# Altium schematic sheet 05_LMS7002M_RF.SchDoc: LMS7002M RF
size A3; Organization: Lime Microsystems; Address1: Surrey Tech Centre; Address2: Guildford GU2 7YG; Address3: Surrey; Address4: United Kingdom; Revision: v1.2; SheetNumber: 5; SheetTotal: 14
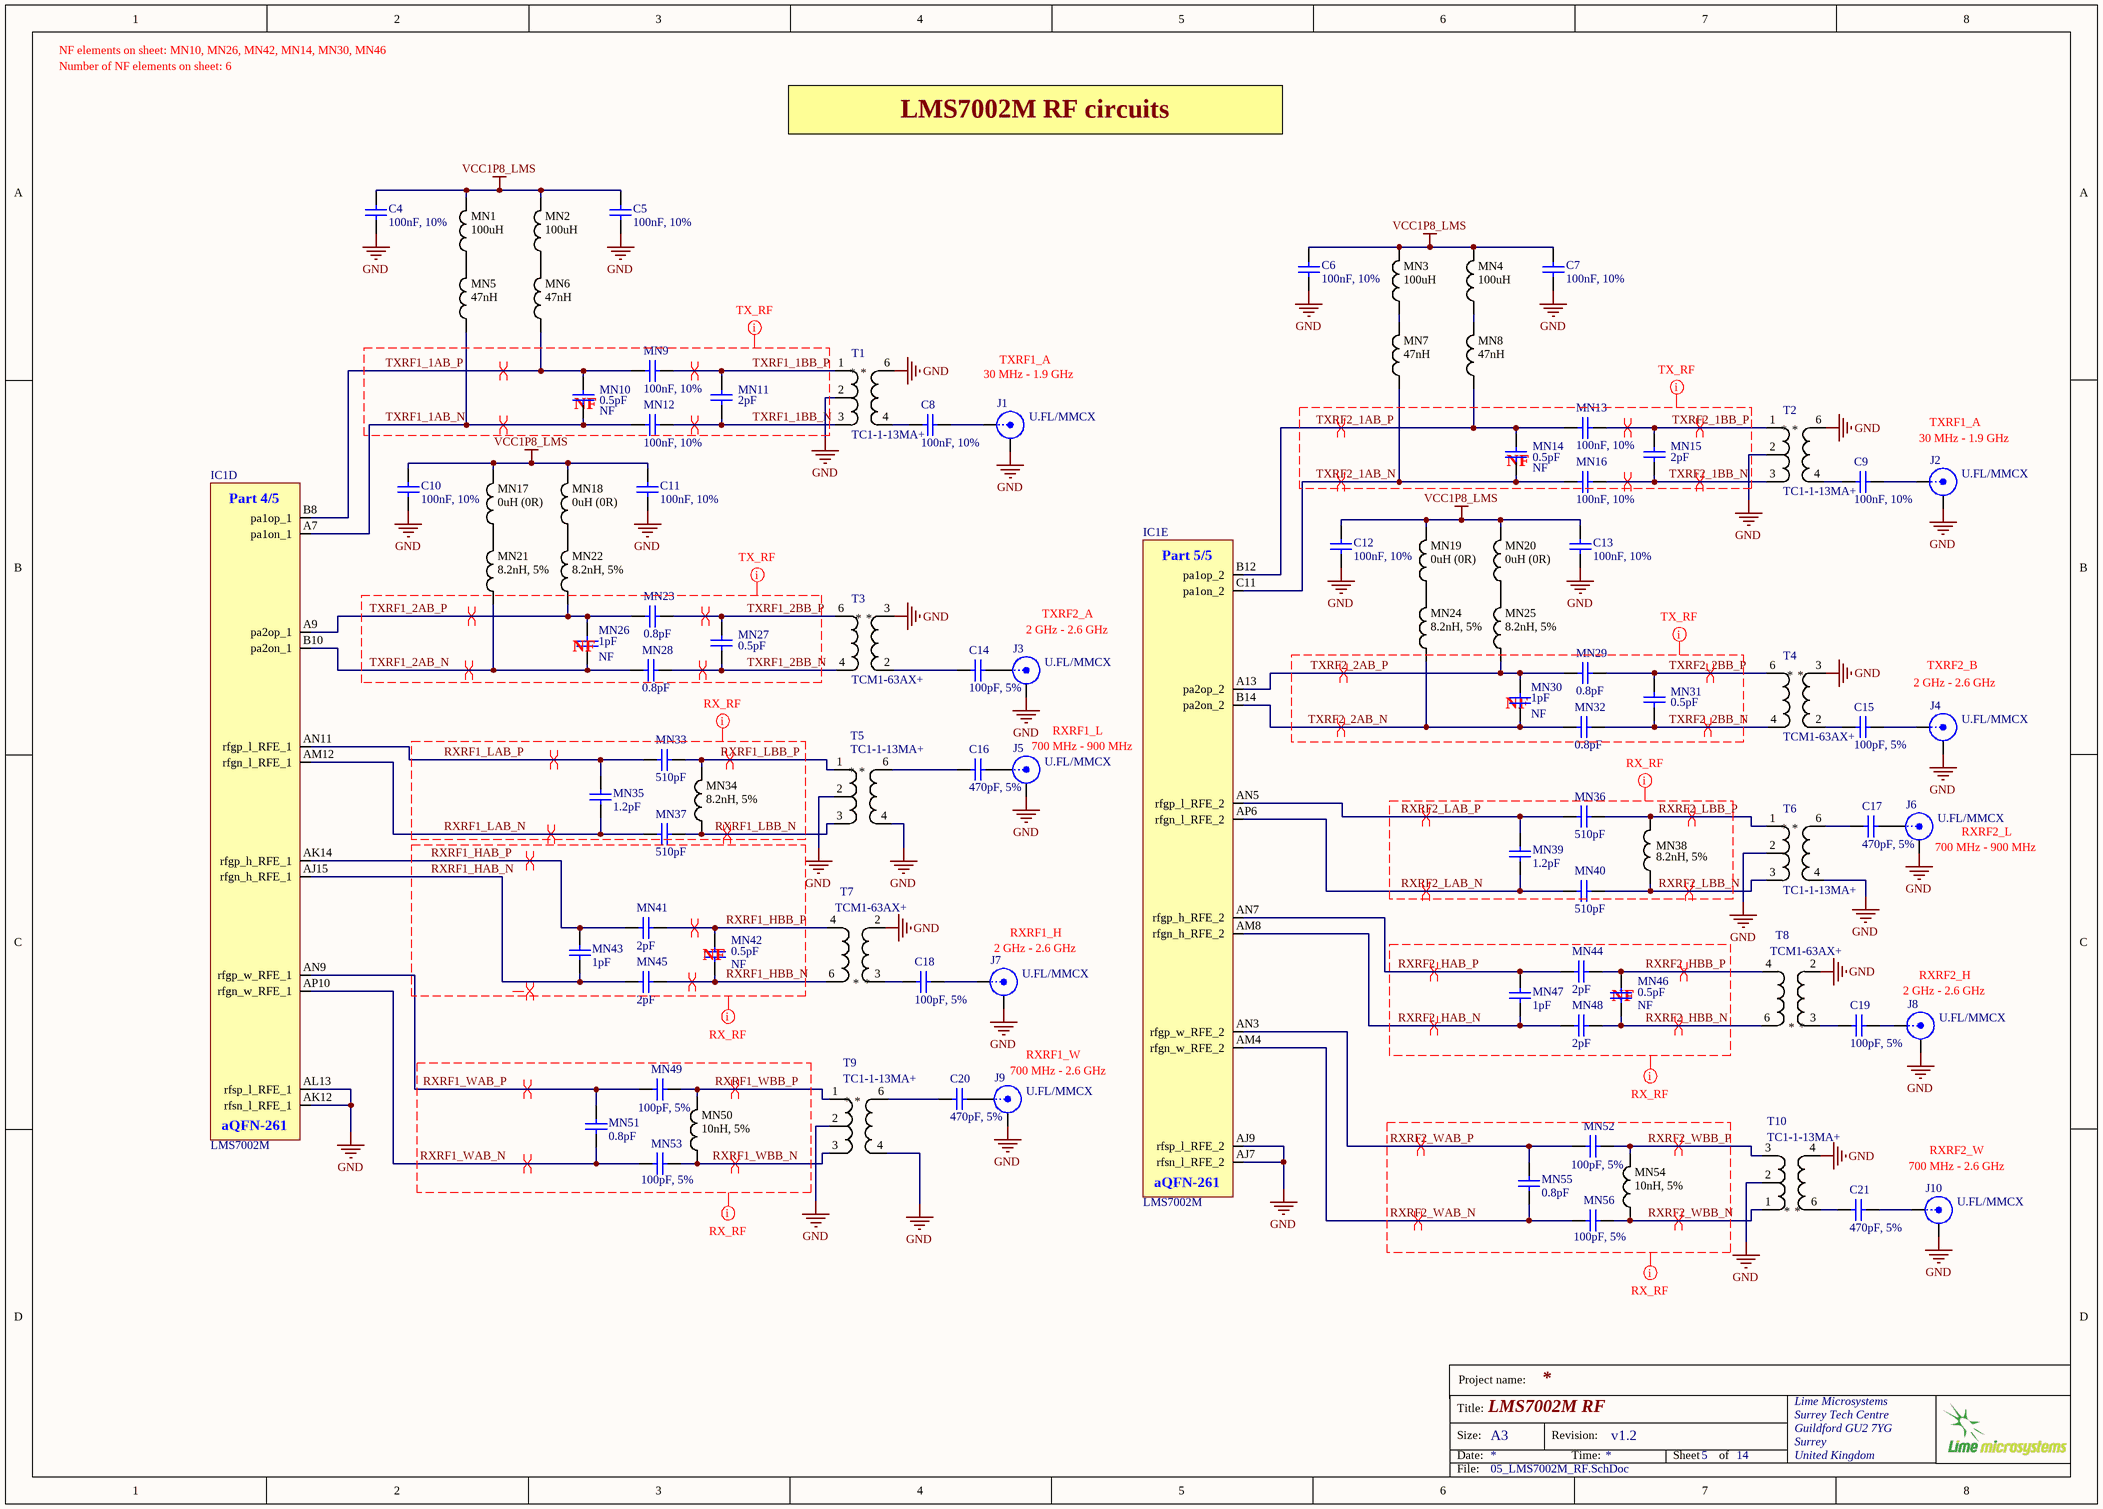
[diagram p0: 05_LMS7002M_RF.SchDoc]

## Parts
C4  100nF, 10%  [CAP0402]
C5  100nF, 10%  [CAP0402]
C6  100nF, 10%  [CAP0402]
C7  100nF, 10%  [CAP0402]
C8  100nF, 10%  [CAP0402]
C9  100nF, 10%  [CAP0402]
C10  100nF, 10%  [CAP0402]
C11  100nF, 10%  [CAP0402]
C12  100nF, 10%  [CAP0402]
C13  100nF, 10%  [CAP0402]
C14  100pF, 5%  [CAP0402]
C15  100pF, 5%  [CAP0402]
C16  470pF, 5%  [CAP0402]
C17  470pF, 5%  [CAP0402]
C18  100pF, 5%  [CAP0402]
C19  100pF, 5%  [CAP0402]
C20  470pF, 5%  [CAP0402]
C21  470pF, 5%  [CAP0402]
IC1  LMS7002M  [LMS7002M]  (parts D,E of 5)
J1  U.FL/MMCX  [MMCX_UFL_conn_u]
J2  U.FL/MMCX  [MMCX_UFL_conn_u]
J3  U.FL/MMCX  [MMCX_UFL_conn_u]
J4  U.FL/MMCX  [MMCX_UFL_conn_u]
J5  U.FL/MMCX  [MMCX_UFL_conn_u]
J6  U.FL/MMCX  [MMCX_UFL_conn_u]
J7  U.FL/MMCX  [MMCX_UFL_conn_u]
J8  U.FL/MMCX  [MMCX_UFL_conn_u]
J9  U.FL/MMCX  [MMCX_UFL_conn_u]
J10  U.FL/MMCX  [MMCX_UFL_conn_u]
MN1  100uH  [RES0805]
MN2  100uH  [RES0805]
MN3  100uH  [RES0805]
MN4  100uH  [RES0805]
MN5  47nH  [RES0402]
MN6  47nH  [RES0402]
MN7  47nH  [RES0402]
MN8  47nH  [RES0402]
MN9  100nF, 10%  [CAP0402]
MN10  0.5pF  Assembly Info: NF  [CAP0402]
MN11  2pF  [CAP0402]
MN12  100nF, 10%  [CAP0402]
MN13  100nF, 10%  [CAP0402]
MN14  0.5pF  Assembly Info: NF  [CAP0402]
MN15  2pF  [CAP0402]
MN16  100nF, 10%  [CAP0402]
MN17  0uH (0R)  [RES0805]
MN18  0uH (0R)  [RES0805]
MN19  0uH (0R)  [RES0805]
MN20  0uH (0R)  [RES0805]
MN21  8.2nH, 5%  [RES0402]
MN22  8.2nH, 5%  [RES0402]
MN23  0.8pF  [CAP0402]
MN24  8.2nH, 5%  [RES0402]
MN25  8.2nH, 5%  [RES0402]
MN26  1pF  Assembly Info: NF  [CAP0402]
MN27  0.5pF  [CAP0402]
MN28  0.8pF  [CAP0402]
MN29  0.8pF  [CAP0402]
MN30  1pF  Assembly Info: NF  [CAP0402]
MN31  0.5pF  [CAP0402]
MN32  0.8pF  [CAP0402]
MN33  510pF  [CAP0402]
MN34  8.2nH, 5%  [RES0402]
MN35  1.2pF  [CAP0402]
MN36  510pF  [CAP0402]
MN37  510pF  [CAP0402]
MN38  8.2nH, 5%  [RES0402]
MN39  1.2pF  [CAP0402]
MN40  510pF  [CAP0402]
MN41  2pF  [CAP0402]
MN42  0.5pF  Assembly Info: NF  [CAP0402]
MN43  1pF  [CAP0402]
MN44  2pF  [CAP0402]
MN45  2pF  [CAP0402]
MN46  0.5pF  Assembly Info: NF  [CAP0402]
MN47  1pF  [CAP0402]
MN48  2pF  [CAP0402]
MN49  100pF, 5%  [CAP0402]
MN50  10nH, 5%  [RES0402]
MN51  0.8pF  [CAP0402]
MN52  100pF, 5%  [CAP0402]
MN53  100pF, 5%  [CAP0402]
MN54  10nH, 5%  [RES0402]
MN55  0.8pF  [CAP0402]
MN56  100pF, 5%  [CAP0402]
T1  TC1-1-13MA+  [TC1-1-13MA+_v2]
T2  TC1-1-13MA+  [TC1-1-13MA+_v2]
T3  TCM1-63AX+  [TCM1-63AX+_v2]
T4  TCM1-63AX+  [TCM1-63AX+_v2]
T5  TC1-1-13MA+  [TC1-1-13MA+_v2]
T6  TC1-1-13MA+  [TC1-1-13MA+_v2]
T7  TCM1-63AX+  [TCM1-63AX+_v2]
T8  TCM1-63AX+  [TCM1-63AX+_v2]
T9  TC1-1-13MA+  [TC1-1-13MA+_v2]
T10  TC1-1-13MA+  [TC1-1-13MA+_v2]

## Nets
GND: C4.1 C5.1 C6.1 C7.1 C10.1 C11.1 C12.1 C13.1 IC1.AJ7(rfsn_l_RFE_2) IC1.AJ9(rfsp_l_RFE_2) IC1.AK12(rfsn_l_RFE_1) IC1.AL13(rfsp_l_RFE_1) J1.2(Y) J2.2(Y) J3.2(Y) J4.2(Y) J5.2(Y) J6.2(Y) J7.2(Y) J8.2(Y) J9.2(Y) J10.2(Y) T1.2 T1.6 T2.2 T2.6 T3.3 T4.3 T5.2 T5.4 T6.2 T6.4 T7.2 T8.2 T9.2 T9.4 T10.2 T10.4
VCC1P8_LMS: C4.2 C5.2 C6.2 C7.2 C10.2 C11.2 C12.2 C13.2 MN1.2 MN2.2 MN3.2 MN4.2 MN17.2 MN18.2 MN19.2 MN20.2
RXRF1_HAB_N: IC1.AJ15(rfgn_h_RFE_1) MN43.1 MN45.2
RXRF1_HAB_P: IC1.AK14(rfgp_h_RFE_1) MN41.2 MN43.2
RXRF1_HBB_N: MN42.1 MN45.1 T7.6
RXRF1_HBB_P: MN41.1 MN42.2 T7.4
RXRF1_LAB_N: IC1.AM12(rfgn_l_RFE_1) MN35.1 MN37.2
RXRF1_LAB_P: IC1.AN11(rfgp_l_RFE_1) MN33.2 MN35.2
RXRF1_LBB_N: MN34.1 MN37.1 T5.3
RXRF1_LBB_P: MN33.1 MN34.2 T5.1
RXRF1_WAB_N: IC1.AP10(rfgn_w_RFE_1) MN51.2 MN53.2
RXRF1_WAB_P: IC1.AN9(rfgp_w_RFE_1) MN49.2 MN51.1
RXRF1_WBB_N: MN50.1 MN53.1 T9.3
RXRF1_WBB_P: MN49.1 MN50.2 T9.1
RXRF2_HAB_N: IC1.AM8(rfgn_h_RFE_2) MN47.1 MN48.2
RXRF2_HAB_P: IC1.AN7(rfgp_h_RFE_2) MN44.2 MN47.2
RXRF2_HBB_N: MN46.1 MN48.1 T8.6
RXRF2_HBB_P: MN44.1 MN46.2 T8.4
RXRF2_LAB_N: IC1.AP6(rfgn_l_RFE_2) MN39.1 MN40.2
RXRF2_LAB_P: IC1.AN5(rfgp_l_RFE_2) MN36.2 MN39.2
RXRF2_LBB_N: MN38.1 MN40.1 T6.3
RXRF2_LBB_P: MN36.1 MN38.2 T6.1
RXRF2_WAB_N: IC1.AM4(rfgn_w_RFE_2) MN55.2 MN56.2
RXRF2_WAB_P: IC1.AN3(rfgp_w_RFE_2) MN52.2 MN55.1
RXRF2_WBB_N: MN54.1 MN56.1 T10.1
RXRF2_WBB_P: MN52.1 MN54.2 T10.3
TXRF1_1AB_N: IC1.A7(pa1on_1) MN5.1 MN10.1 MN12.1
TXRF1_1AB_P: IC1.B8(pa1op_1) MN6.1 MN9.2 MN10.2
TXRF1_1BB_N: MN11.1 MN12.2 T1.3
TXRF1_1BB_P: MN9.1 MN11.2 T1.1
TXRF1_2AB_N: IC1.B10(pa2on_1) MN21.1 MN26.2 MN28.2
TXRF1_2AB_P: IC1.A9(pa2op_1) MN22.1 MN23.2 MN26.1
TXRF1_2BB_N: MN27.1 MN28.1 T3.4
TXRF1_2BB_P: MN23.1 MN27.2 T3.6
TXRF2_1AB_N: IC1.C11(pa1on_2) MN7.1 MN14.1 MN16.1
TXRF2_1AB_P: IC1.B12(pa1op_2) MN8.1 MN13.2 MN14.2
TXRF2_1BB_N: MN15.1 MN16.2 T2.3
TXRF2_1BB_P: MN13.1 MN15.2 T2.1
TXRF2_2AB_N: IC1.B14(pa2on_2) MN24.1 MN30.2 MN32.2
TXRF2_2AB_P: IC1.A13(pa2op_2) MN25.1 MN29.2 MN30.1
TXRF2_2BB_N: MN31.1 MN32.1 T4.4
TXRF2_2BB_P: MN29.1 MN31.2 T4.6
NetC8_1: C8.1 J1.1(X)
NetC8_2: C8.2 T1.4
NetC9_1: C9.1 J2.1(X)
NetC9_2: C9.2 T2.4
NetC14_1: C14.1 J3.1(X)
NetC14_2: C14.2 T3.2
NetC15_1: C15.1 J4.1(X)
NetC15_2: C15.2 T4.2
NetC16_1: C16.1 J5.1(X)
NetC16_2: C16.2 T5.6
NetC17_1: C17.1 J6.1(X)
NetC17_2: C17.2 T6.6
NetC18_1: C18.1 J7.1(X)
NetC18_2: C18.2 T7.3
NetC19_1: C19.1 J8.1(X)
NetC19_2: C19.2 T8.3
NetC20_1: C20.1 J9.1(X)
NetC20_2: C20.2 T9.6
NetC21_1: C21.1 J10.1(X)
NetC21_2: C21.2 T10.6
NetMN1_1: MN1.1 MN5.2
NetMN2_1: MN2.1 MN6.2
NetMN3_1: MN3.1 MN7.2
NetMN4_1: MN4.1 MN8.2
NetMN17_1: MN17.1 MN21.2
NetMN18_1: MN18.1 MN22.2
NetMN19_1: MN19.1 MN24.2
NetMN20_1: MN20.1 MN25.2

## Layout directives
differential pair: RXRF1_HAB_N, RXRF1_HAB_P, RXRF1_HBB_N, RXRF1_HBB_P, RXRF1_LAB_N, RXRF1_LAB_P, RXRF1_LBB_N, RXRF1_LBB_P, RXRF1_WAB_N, RXRF1_WAB_P, RXRF1_WBB_N, RXRF1_WBB_P, RXRF2_HAB_N, RXRF2_HAB_P, RXRF2_HBB_N, RXRF2_HBB_P, RXRF2_LAB_N, RXRF2_LAB_P, RXRF2_LBB_N, RXRF2_LBB_P, RXRF2_WAB_N, RXRF2_WAB_P, RXRF2_WBB_N, RXRF2_WBB_P, TXRF1_1AB_N, TXRF1_1AB_P, TXRF1_1BB_N, TXRF1_1BB_P, TXRF1_2AB_N, TXRF1_2AB_P, TXRF1_2BB_N, TXRF1_2BB_P, TXRF2_1AB_N, TXRF2_1AB_P, TXRF2_1BB_N, TXRF2_1BB_P, TXRF2_2AB_N, TXRF2_2AB_P, TXRF2_2BB_N, TXRF2_2BB_P
net class TX_RF: TXRF1_1AB_N, TXRF1_1AB_P, TXRF1_1BB_N, TXRF1_1BB_P, TXRF1_2AB_N, TXRF1_2AB_P, TXRF1_2BB_N, TXRF1_2BB_P, TXRF2_1AB_N, TXRF2_1AB_P, TXRF2_1BB_N, TXRF2_1BB_P, TXRF2_2AB_N, TXRF2_2AB_P, TXRF2_2BB_N, TXRF2_2BB_P
net class RX_RF: RXRF1_HAB_N, RXRF1_HAB_P, RXRF1_HBB_N, RXRF1_HBB_P, RXRF1_LAB_N, RXRF1_LAB_P, RXRF1_LBB_N, RXRF1_LBB_P, RXRF1_WAB_N, RXRF1_WAB_P, RXRF1_WBB_N, RXRF1_WBB_P, RXRF2_HAB_N, RXRF2_HAB_P, RXRF2_HBB_N, RXRF2_HBB_P, RXRF2_LAB_N, RXRF2_LAB_P, RXRF2_LBB_N, RXRF2_LBB_P, RXRF2_WAB_N, RXRF2_WAB_P, RXRF2_WBB_N, RXRF2_WBB_P

## Notes on the sheet
- Number of NF elements on sheet: 6
- NF elements on sheet: MN10, MN26, MN42, MN14, MN30, MN46
- LMS7002M RF circuits
- 30 MHz - 1.9 GHz
- TXRF1_A
- (near MN10) NF
- (near J2) 30 MHz - 1.9 GHz
- (near MN14) NF
- (near MN26) NF
- 2 GHz - 2.6 GHz
- TXRF2_A
- (near MN30) NF
- TXRF2_B
- (near J5) 700 MHz - 900 MHz
- RXRF1_L
- (near J6) 700 MHz - 900 MHz
- (near J6) RXRF2_L
- (near MN42) NF
- (near J7) 2 GHz - 2.6 GHz
- (near J7) RXRF1_H
- RXRF2_H
- RXRF1_W
- (near MN46) NF
- (near J8) 2 GHz - 2.6 GHz
- (near J9) 700 MHz - 2.6 GHz
- 700 MHz - 2.6 GHz
- (near J10) RXRF2_W
- Project name:
- Title:
- Size:
- Date:
- A3
- Revision:
- Time:
- Sheet
- of
- File:
- (in symbol LMS7002M, part D) Part 4/5; aQFN-261
- (in symbol LMS7002M, part E) Part 5/5; aQFN-261

## Library data of the parts
C4-C13 = Cap_0402: Manufacturer: Murata Electronics; Manufacturer Part Number: GRM155R71C104KA88D; Part Description: 0.10µF ±10% 16V X7R Ceramic Capacitor -55°C ~ 125°C Surface Mount, MLCC 0402 (1005 Metric) 0.039" L x 0.020" W (1.00mm x 0.50mm); Voltage Rating DC: 16 V; Type: General Purpose MLCC; Capacitance: 0.1 uF; Case Length: 1 mm; Dielectric: X7R; Case Height: 0.5 mm; Temperature Coefficient / Code: +/- 15 %; Value: 100nF, 10%; Supplier 1: Mouser; Supplier Part Number 1: 81-GRM155R71C104KA88; Case Code - in: 0402; RoHS: RoHS Compliant; Operating Temperature Range: - 55 C to + 125 C; Series: GRM; Termination Style: SMD/SMT; Tolerance: 10 %; Package / Case: 0402 (1005 metric); Maximum Operating Temperature: + 125 C; Case Code - mm: 1005; Minimum Operating Temperature: - 55 C; Product Category: Low & Medium Capacitance SMD Ceramic Chip Capacitors; Packaging: Reel; Product: General Type MLCCs; Category: Multilayer Ceramic Capacitors MLCC - SMD/SMT; Brand: Murata Electronics; Case Width: 0.5 mm; RoHS - Mouser: Y; Standard Pack Qty: 10000; Minimum Order Quantity: 1; Reeling: True; Manufacturer Part Number 1: GRM155R71C104KA88D
C14 C15 C18 C19 MN49 MN52 MN53 MN56 = Cap_0402: Manufacturer Part Number 1: CC0402JRNPO9BN101; Manufacturer: Yageo; Part Description: 100pF ±5% 50V C0G, NP0 Ceramic Capacitor -55°C ~ 125°C Surface Mount, MLCC 0402 (1005 Metric) 0.039" L x 0.020" W (1.00mm x 0.50mm); Temperature Coefficient: C0G, NP0; Voltage - Rated: 50V; Value: 100pF, 5%; Capacitance: 100pF; Thickness (Max): 0.022" (0.55mm); Size / Dimension: 0.039" L x 0.020" W (1.00mm x 0.50mm); Tolerance: ±5%; RoHS: RoHS Compliant; Ratings: -; Package / Case: 0402 (1005 Metric); Mounting Type: Surface Mount, MLCC; Height - Seated (Max): -; Features: -; Lead Spacing: -; Operating Temperature: -55°C ~ 125°C; Packaging: Cut Tape (CT); Applications: General Purpose; Lead Style: -; Supplier 1: Digi-Key; Category: Capacitors; Supplier Part Number 1: 311-1024-1-ND
C16 C17 C20 C21 = Cap_0402: Manufacturer Part Number: C1005C0G1H471J050BA; Manufacturer: TDK Corporation; Part Description: 470pF ±5% 50V C0G, NP0 Ceramic Capacitor -55°C ~ 125°C Surface Mount, MLCC 0402 (1005 Metric) 0.039" L x 0.020" W (1.00mm x 0.50mm); Temperature Coefficient: C0G, NP0; Voltage - Rated: 50V; Value: 470pF, 5%; Supplier 1: Digi-Key; Supplier Part Number 1: 445-2656-6-ND; Ratings: -; Package / Case: 0402 (1005 Metric); Capacitance: 470pF; Packaging: Digi-Reel®; RoHS: RoHS Compliant; Tolerance: ±5%; Lead Style: -; Thickness (Max): 0.022" (0.55mm); Size / Dimension: 0.039" L x 0.020" W (1.00mm x 0.50mm); Lead Spacing: -; Operating Temperature: -55°C ~ 125°C; Height - Seated (Max): -; Applications: General Purpose; Mounting Type: Surface Mount, MLCC; Category: Capacitors; Features: -
IC1 = LMS7002M: Part Description: IC FPRF Transceiver LMS7002M; 261 pin aQFN; Manufacturer: Lime Microsystems; Manufacturer Part Number 1: LMS7002M; Supplier 1: Lime Microsystems; Supplier Part Number 1: LMS7002M
J1-J10 = RF_IF_connector: CONN UMC RCPT STR 50 OHM SMD; Manufacturer: Molex, LLC; Manufacturer Part Number 1: 0734120110; Body Finish: Nickel; Body Material: Phosphor Bronze; Center Contact Material: Brass; Center Contact Plating: Gold; Connector Style: Ultra Miniature Coaxial; Connector Type: Jack, Male Pin; Contact Termination: Solder; Dielectric Material: Liquid Crystal Polymer (LCP); Frequency - Max: 6GHz; Impedance: 50 Ohm; Voltage Rating: 60V; Cable Group: -; Category: Connectors, Interconnects; Fastening Type: Snap-On; Features: -; Housing Color: Silver; Ingress Protection: -; Mounting Type: Surface Mount; Operating Temperature: -40°C ~ 90°C; Packaging: Cut Tape (CT); RoHS: RoHS Compliant; Shield Termination: Solder; Supplier 1: Digi-Key; Supplier Part Number 1: WM5587CT-ND; Part Description: CONN UMC RCPT STR 50 OHM SMD
MN1-MN4 = Inductor_0603: Manufacturer: TDK Corporation; Manufacturer Part Number: MLF2012C101KT000; Part Description: FIXED IND 100UH 2MA 3.1 OHM SMD; Q @ Freq: 25 @ 1MHz; Shielding: Shielded; Current Rating: 2mA; Frequency - Self Resonant: 7MHz; Frequency - Test: 1MHz; Material - Core: Ferrite; Tolerance: ±10%; Inductance: 100µH; DC Resistance (DCR): 3.1 Ohm Max; Value: 100uH; Supplier 1: Digi-Key; Supplier Part Number 1: 445-1071-1-ND; Supplier Device Package: 0805 (2012 Metric); Size / Dimension: 0.079" L x 0.049" W (2.00mm x 1.25mm); Operating Temperature: -40°C ~ 85°C; Packaging: Cut Tape (CT); RoHS: RoHS Compliant; Current - Saturation: -; Height - Seated (Max): 0.057" (1.45mm); Package / Case: 0805 (2012 Metric); Mounting Type: Surface Mount; Type: Multilayer; Category: Inductors, Coils, Chokes
MN5-MN8 = Inductor_0603: Manufacturer: COILCRAFT; Manufacturer Part Number: 0402HP-47NXJLU; Part Description: INDUCTOR, RF, 47NH, 5%, 2.4GHZ, SMD; Product Range:0402HP Series; Inductance:47nH; Inductance Tolerance:± 5%; High Frequency Inductor Case:0402 [1005 Metric]; Self Resonant Frequency Min:2.4GHz; DC Resistance Max:0.58ohm; DC Current Rating:420mA; SVHC: No SVHC (15-Jun-2015); Inductance Tolerance: ± 5%; High Frequency Inductor Case: 0402 [1005 Metric]; Inductor Case Style: 0402 [1005 Metric]<!--FANDB--><div class="features-and-benefits-container"></div>; Inductance: 47; DC Resistance Max: 0.58; Self Resonant Frequency Min: 2.4; Product Range: 0402; DC Current Rating: 420; Inductor Construction: Wirewound; Supplier 1: Farnell; Supplier Part Number 1: 2285856; Packaging: Cut Tape; RoHS: Y-EX; value: 47nH
MN9 MN12 MN13 MN16 = Cap_0402: Manufacturer: Murata Electronics; Manufacturer Part Number: GRM155R71C104KA88D; Part Description: 0.10µF ±10% 16V X7R Ceramic Capacitor -55°C ~ 125°C Surface Mount, MLCC 0402 (1005 Metric) 0.039" L x 0.020" W (1.00mm x 0.50mm); Voltage Rating DC: 16 V; Capacitance: 0.1 uF; Case Length: 1 mm; Dielectric: X7R; Case Height: 0.5 mm; Temperature Coefficient / Code: +/- 15 %; Value: 100nF, 10%; Supplier 1: Mouser; Supplier Part Number 1: 81-GRM155R71C104KA88; Case Code - in: 0402; RoHS: RoHS Compliant; Operating Temperature Range: - 55 C to + 125 C; Series: GRM; Termination Style: SMD/SMT; Tolerance: 10 %; Package / Case: 0402 (1005 metric); Type: General Purpose MLCC; Maximum Operating Temperature: + 125 C; Case Code - mm: 1005; Minimum Operating Temperature: - 55 C; Product Category: Low & Medium Capacitance SMD Ceramic Chip Capacitors; Packaging: Reel; Product: General Type MLCCs; Category: Multilayer Ceramic Capacitors MLCC - SMD/SMT; Brand: Murata Electronics; Case Width: 0.5 mm; RoHS - Mouser: Y; Standard Pack Qty: 10000; Minimum Order Quantity: 1; Reeling: True; Manufacturer Part Number 1: GRM155R71C104KA88D
MN10 MN14 MN27 MN31 MN42 MN46 = Cap_0402: Manufacturer: Yageo; Manufacturer Part Number 1: CC0402CRNPO9BNR50; Part Description: 0.50pF ±0.25pF 50V C0G, NP0 Ceramic Capacitor -55°C ~ 125°C Surface Mount, MLCC 0402 (1005 Metric) 0.039" L x 0.020" W (1.00mm x 0.50mm); Capacitance: 0.50pF; Voltage - Rated: 50V; Temperature Coefficient: C0G, NP0; Tolerance: ±0.25pF; Value: 0.5pF; Supplier 1: Digi-Key; Supplier Part Number 1: 311-1001-1-ND; RoHS: RoHS Compliant; Thickness (Max): 0.022" (0.55mm); Features: -; Height - Seated (Max): -; Lead Spacing: -; Applications: General Purpose; Packaging: Cut Tape (CT); Ratings: -; Size / Dimension: 0.039" L x 0.020" W (1.00mm x 0.50mm); Lead Style: -; Mounting Type: Surface Mount, MLCC; Operating Temperature: -55°C ~ 125°C; Package / Case: 0402 (1005 Metric); Category: Capacitors
MN11 MN15 MN41 MN44 MN45 MN48 = Cap_0402: Manufacturer Part Number: 04025U2R0BAT2A; Manufacturer: AVX; Part Description: 2pF ±0.1pF 50V C0G, NP0 Ceramic Capacitor -55°C ~ 125°C Surface Mount, MLCC 0402 (1005 Metric) 0.039" L x 0.020" W (1.00mm x 0.50mm); Product Range: U Series; Voltage Rating: 50; SVHC: No SVHC (17-Dec-2014); Capacitance Tolerance: ± 0.1; Ceramic Capacitor Case: 0402 [1005 Metric]; Capacitance: 2; Dielectric Characteristic: C0G / NP0; Value: 2pF; Supplier 1: Farnell; Supplier Part Number 1: 2332536; Operating Temperature Max: 125; RoHS: YES; Operating Temperature Min: -55; Capacitance Tolerance ±: ± 0.1; Packaging: Cut Tape; MSL: MSL 1 - Unlimited
MN17-MN20 = Inductor_0603: Manufacturer: BOURNS; Manufacturer Part Number 1: CR0805-J/-000ELF; Part Description: RES SMD 0.0 OHM JUMPER 1/8W 0805; Value: 0uH (0R); Supplier 1: Farnell; Supplier Part Number 1: 2008388; RoHS: YES
MN21 MN22 MN24 MN25 MN34 MN38 = Inductor_0603: Manufacturer: COILCRAFT; Manufacturer Part Number 1: 0402HP-8N2XJLU; Part Description: INDUCTOR, RF, 8.2NH, 5%, 5.4GHZ, SMD; Product Range:0402HP Series; Inductance:8.2nH; Inductance Tolerance:± 5%; High Frequency Inductor Case:0402 [1005 Metric]; Self Resonant Frequency Min:5.4GHz; DC Resistance Max:0.065ohm; DC Current Rating:1.5A; Inductor Construction: Wirewound; DC Current Rating: 1.5; Inductor Case Style: 0402 [1005 Metric]<!--FANDB--><div class="features-and-benefits-container"></div>; Self Resonant Frequency Min: 5.4; DC Resistance Max: 0.065; High Frequency Inductor Case: 0402 [1005 Metric]; SVHC: No SVHC (16-Jun-2014); Inductance: 8.2; Supplier 1: Farnell; Supplier Part Number 1: 2285826; Packaging: Cut Tape; Product Range: COILCRAFT - 0402; Inductance Tolerance: ± 5%; RoHS: Y-EX; Value: 8.2nH, 5%
MN23 MN28 MN29 MN32 MN51 MN55 = Cap_0402: Manufacturer: Murata Electronics North America; Manufacturer Part Number: GRM1555C1HR80BA01D; Part Description: 0.80pF ±0.1pF 50V C0G, NP0 Ceramic Capacitor -55°C ~ 125°C Surface Mount, MLCC 0402 (1005 Metric) 0.039" L x 0.020" W (1.00mm x 0.50mm); Temperature Coefficient: C0G, NP0; Capacitance: 0.80pF; Voltage - Rated: 50V; Tolerance: ±0.1pF; Value: 0.8pF; Applications: General Purpose; Operating Temperature: -55°C ~ 125°C; Size / Dimension: 0.039" L x 0.020" W (1.00mm x 0.50mm); Features: -; Supplier 1: Digi-Key; Height - Seated (Max): -; Category: Capacitors; Package / Case: 0402 (1005 Metric); Mounting Type: Surface Mount, MLCC; Lead Spacing: -; Thickness (Max): 0.022" (0.55mm); RoHS: RoHS Compliant; Supplier Part Number 1: 490-6269-1-ND; Packaging: Cut Tape (CT); Ratings: -; Lead Style: -
MN26 MN30 MN43 MN47 = Cap_0402: Manufacturer: TDK Corporation; Manufacturer Part Number 1: C1005C0G1H010B050BA; Part Description: 1pF ±0.1pF 50V C0G, NP0 Ceramic Capacitor -55°C ~ 125°C Surface Mount, MLCC 0402 (1005 Metric) 0.039" L x 0.020" W (1.00mm x 0.50mm); Voltage - Rated: 50V; Temperature Coefficient: C0G, NP0; Tolerance: ±0.1pF; Value: 1pF; Supplier 1: Digi-Key; Supplier Part Number 1: 445-4854-6-ND; Size / Dimension: 0.039" L x 0.020" W (1.00mm x 0.50mm); Lead Spacing: -; Operating Temperature: -55°C ~ 125°C; Thickness (Max): 0.022" (0.55mm); Package / Case: 0402 (1005 Metric); Features: -; Lead Style: -; Applications: General Purpose; Height - Seated (Max): -; Capacitance: 1pF; RoHS: RoHS Compliant; Mounting Type: Surface Mount, MLCC; Packaging: Digi-Reel®; Ratings: -; Category: Capacitors
MN33 MN36 MN37 MN40 = Cap_0402: Manufacturer: Murata Electronics North America; Manufacturer Part Number: GRM1555C1H511JA01D; Part Description: 510pF ±5% 50V C0G, NP0 Ceramic Capacitor -55°C ~ 125°C Surface Mount, MLCC 0402 (1005 Metric) 0.039" L x 0.020" W (1.00mm x 0.50mm); Voltage - Rated: 50V; Temperature Coefficient: C0G, NP0; Tolerance: ±5%; Value: 510pF; Supplier 1: Digi-Key; Supplier Part Number 1: 490-3237-1-ND; Height - Seated (Max): -; Features: -; Size / Dimension: 0.039" L x 0.020" W (1.00mm x 0.50mm); Applications: General Purpose; Lead Spacing: -; Package / Case: 0402 (1005 Metric); Ratings: -; Thickness (Max): 0.022" (0.55mm); Lead Style: -; Operating Temperature: -55°C ~ 125°C; Mounting Type: Surface Mount, MLCC; Capacitance: 510pF; Category: Capacitors; RoHS: RoHS Compliant; Packaging: Cut Tape (CT)
MN35 MN39 = Cap_0402: Manufacturer: Murata Electronics North America; Manufacturer Part Number: GRM1555C1H1R2CA01D; Part Description: 1.2pF ±0.25pF 50V C0G, NP0 Ceramic Capacitor -55°C ~ 125°C Surface Mount, MLCC 0402 (1005 Metric) 0.039" L x 0.020" W (1.00mm x 0.50mm); Temperature Coefficient: C0G, NP0; Voltage - Rated: 50V; Tolerance: ±0.25pF; Value: 1.2pF; Supplier 1: Digi-Key; Supplier Part Number 1: 490-5927-1-ND; Lead Style: -; Category: Capacitors; Features: -; Packaging: Cut Tape (CT); Operating Temperature: -55°C ~ 125°C; Package / Case: 0402 (1005 Metric); Applications: General Purpose; Size / Dimension: 0.039" L x 0.020" W (1.00mm x 0.50mm); Lead Spacing: -; Ratings: -; Mounting Type: Surface Mount, MLCC; RoHS: RoHS Compliant; Height - Seated (Max): -; Thickness (Max): 0.022" (0.55mm); Capacitance: 1.2pF
MN50 MN54 = Inductor_0603: Manufacturer Part Number 1: 0402HP-10NXJLU; Manufacturer: COILCRAFT; Part Description: INDUCTOR, RF, 10NH, 5%, 4.7GHZ, SMD; Product Range:0402HP Series; Inductance:10nH; Inductance Tolerance:± 5%; High Frequency Inductor Case:0402 [1005 Metric]; Self Resonant Frequency Min:4.7GHz; DC Resistance Max:0.11ohm; DC Current Rating:1.3A; Value: 10nH, 5%; Supplier 1: Farnell; Supplier Part Number 1: 2285830; RoHS: Y-EX
T1 T2 T5 T6 T9 T10 = Balun: Manufacturer: Mini-Circuits; Part Description: RF balun, TC1-1-13MA+; Manufacturer Part Number 1: TC1-1-13MA+; Supplier Part Number 1: TC1-1-13MA+; Supplier 1: Minicircuits
T3 T4 T7 T8 = Balun_v2: Manufacturer: Mini-circuits; Part Description: RF balun, TCM1-63AX+; Supplier Part Number 1: TCM1-63AX+; Manufacturer Part Number 1: TCM1-63AX+; Supplier 1: Minicircuits